# EAGLE schematic front_compact (EAGLE 4.11)
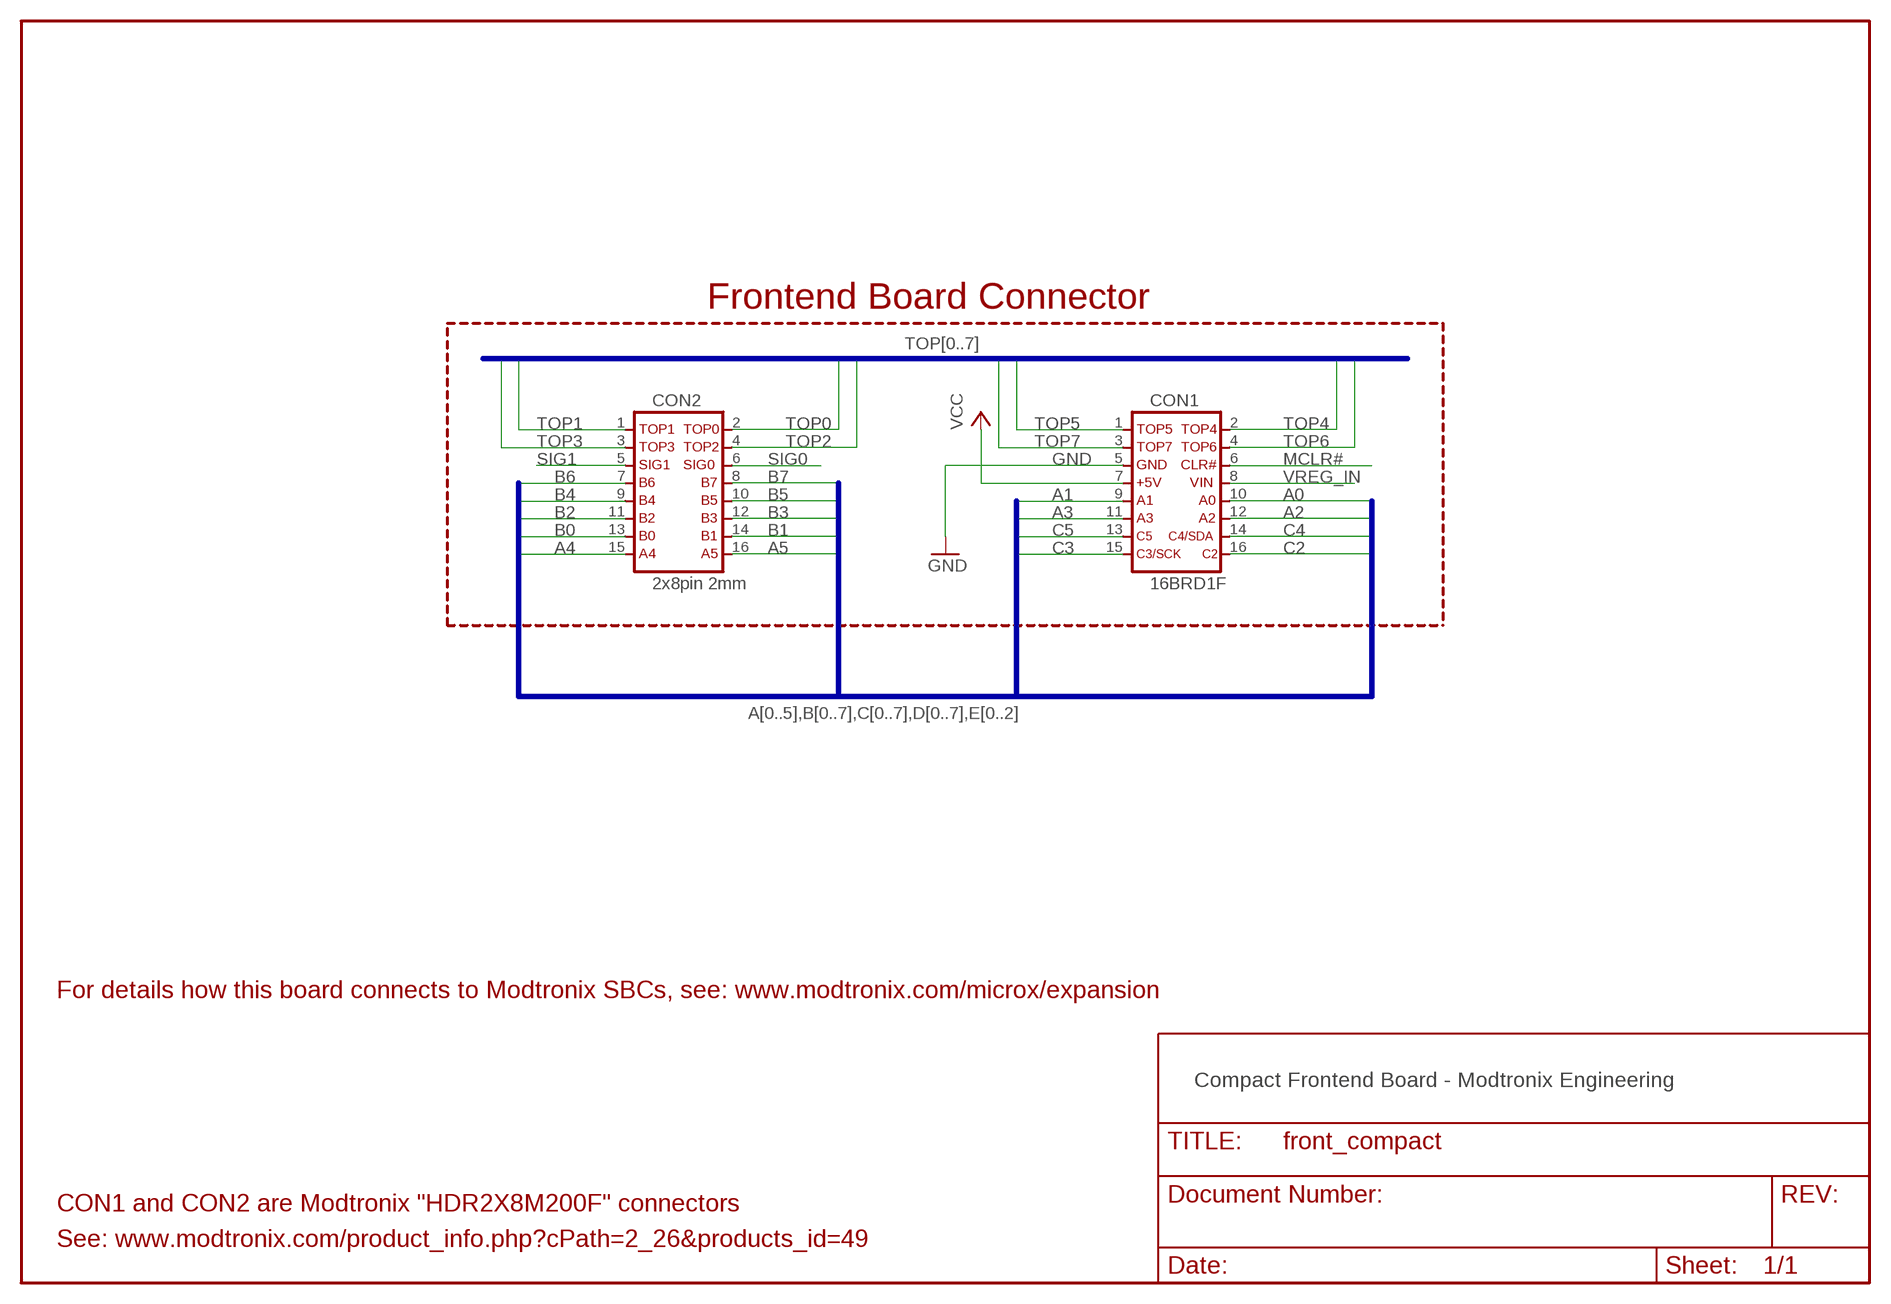
[diagram p0: schematic, sheet 1]

## Parts
CON1  16BRD1F  [16BRD_FRONT]
CON2  2x8pin 2mm  16BRD2F  [16BRD_FRONTR]

## Nets
A0: CON1.10
A1: CON1.9
A2: CON1.12
A3: CON1.11
A4: CON2.15
A5: CON2.16
B0: CON2.13
B1: CON2.14
B2: CON2.11
B3: CON2.12
B4: CON2.9
B5: CON2.10
B6: CON2.7
B7: CON2.8
C2: CON1.16
C3: CON1.15
C4: CON1.14
C5: CON1.13
GND [power]: CON1.5
MCLR#: CON1.6
SIG0: CON2.6
SIG1: CON2.5
TOP0: CON2.2
TOP1: CON2.1
TOP2: CON2.4
TOP3: CON2.3
TOP4: CON1.2
TOP5: CON1.1
TOP6: CON1.4
TOP7: CON1.3
VCC [power]: CON1.7
VREG_IN: CON1.8

## Buses
A[0..5],B[0..7],C[0..7],D[0..7],E[0..2]
TOP[0..7]

## Notes on the sheet
- Frontend Board Connector
- For details how this board connects to Modtronix SBCs, see: www.modtronix.com/microx/expansion
- Compact Frontend Board - Modtronix Engineering
- CON1 and CON2 are Modtronix "HDR2X8M200F" connectors
- See: www.modtronix.com/product_info.php?cPath=2_26&products_id=49

## Library data of the parts
CON1 = david:16BRD1
CON2 = david:16BRD2

## Net classes
0 default: width 0.356 mm, clearance 0.61 mm
1 power: width 0.508 mm, clearance 0.61 mm